# Altium project E32.PrjPcb
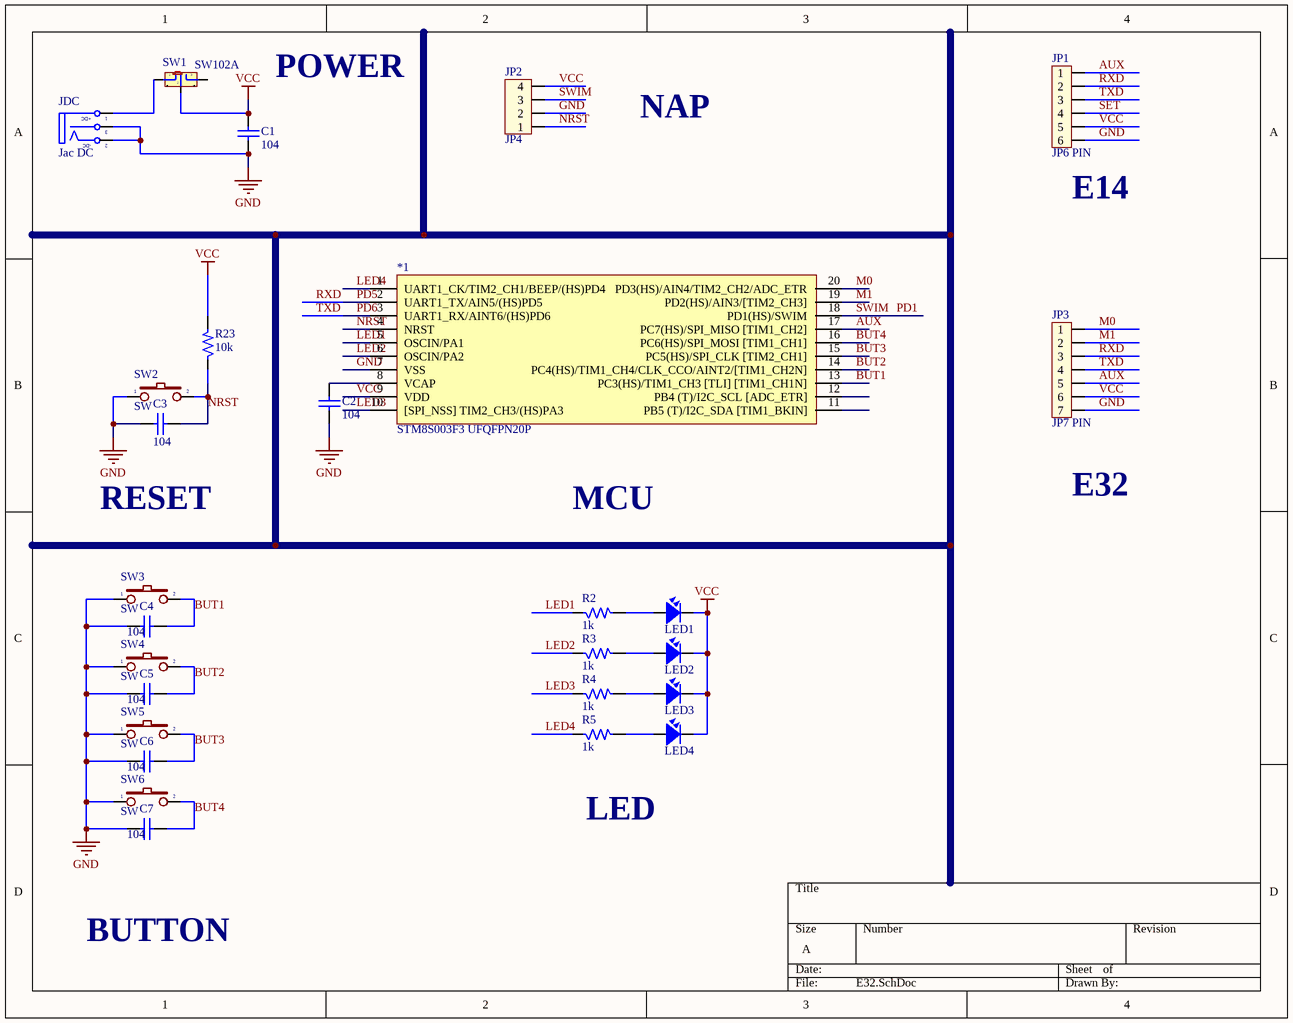
[diagram p0: E32.SchDoc]
1 sheet, 27 parts. Net scope: global (net labels, ports and power ports of the same name join across sheets).
Board files: E32.PcbDoc, MACHIN.PcbDoc

## Sheet E32.SchDoc
size A

### Parts
*1  STM8S003F3 UFQFPN20P  [TSOP65-20BN]
C1  104  [SM-CAP-0805]
C2  104  [SM-CAP-0805]
C3  104  [SM-CAP-0805]
C4  104  [SM-CAP-0805]
C5  104  [SM-CAP-0805]
C6  104  [SM-CAP-0805]
C7  104  [SM-CAP-0805]
JDC  Jac DC  [DC-IN]
JP1  JP6 PIN  [JP6]
JP2  JP4  [CON4]
JP3  JP7 PIN  [JP7]
LED1  LED  [LED-3]  (value not drawn)
LED2  LED  [LED-3]  (value not drawn)
LED3  LED  [LED-3]  (value not drawn)
LED4  LED  [LED-3]  (value not drawn)
R2  1k  [SM-RES-1206]
R3  1k  [SM-RES-1206]
R4  1k  [SM-RES-1206]
R5  1k  [SM-RES-1206]
R23  10k  [SM-RES-1206]
SW1  SW102A  [SW102T]
SW2  SW  [SW2]
SW3  SW  [SW2]
SW4  SW  [SW2]
SW5  SW  [SW2]
SW6  SW  [SW2]

### Nets
GND: *1.7(VSS) C1.1 C2.1 C3.1 C4.1 C5.1 C6.1 C7.1 JDC.2(TN) JDC.3(S) JP1.6 JP2.2 JP3.7 SW2.1 SW3.1 SW4.1 SW5.1 SW6.1
VCC: *1.9(VDD) C1.2 JP1.5 JP2.4 JP3.6 LED1.2 LED2.2 LED3.2 LED4.2 R23.2 SW1.2
AUX: *1.17(PC7(HS)/SPI_MISO_[TIM1_CH2]) JP1.1 JP3.5
BUT1: *1.13(PC3(HS)/TIM1_CH3_[TLI]_[TIM1_CH1N]) C4.2 SW3.2
BUT2: *1.14(PC4(HS)/TIM1_CH4/CLK_CCO/AINT2/[TIM1_CH2N]) C5.2 SW4.2
BUT3: *1.15(PC5(HS)/SPI_CLK_[TIM2_CH1]) C6.2 SW5.2
BUT4: *1.16(PC6(HS)/SPI_MOSI_[TIM1_CH1]) C7.2 SW6.2
LED1: *1.5(OSCIN/PA1) R2.1
LED2: *1.6(OSCIN/PA2) R3.1
LED3: *1.10([SPI_NSS]_TIM2_CH3/(HS)PA3) R4.1
LED4: *1.1(UART1_CK/TIM2_CH1/BEEP/(HS)PD4) R5.1
M0: *1.20(PD3(HS)/AIN4/TIM2_CH2/ADC_ETR) JP3.1
M1: *1.19(PD2(HS)/AIN3/[TIM2_CH3]) JP3.2
NRST: *1.4(NRST) C3.2 JP2.1 R23.1 SW2.2
PD1: *1.18(PD1(HS)/SWIM) JP2.3  [also labelled SWIM]
PD5: *1.2(UART1_TX/AIN5/(HS)PD5) JP1.2 JP3.3  [also labelled RXD]
PD6: *1.3(UART1_RX/AINT6/(HS)PD6) JP1.3 JP3.4  [also labelled TXD]
SET: JP1.4
Net*1_8: *1.8(VCAP) C2.2
NetJDC_1: JDC.1(T) SW1.1
NetLED1_1: LED1.1 R2.2
NetLED2_1: LED2.1 R3.2
NetLED3_1: LED3.1 R4.2
NetLED4_1: LED4.1 R5.2

Not connected (* = marked no-connect by the designer): *1 11(PB5_(T)/I2C_SDA_[TIM1_BKIN]) 12(PB4_(T)/I2C_SCL_[ADC_ETR]); SW1 3 4 5

### Notes on the sheet
- (near C1) POWER
- NAP
- (near JP1) E14
- E32
- RESET
- MCU
- LED
- BUTTON
- (in symbol DCIN) +DC; -DC

### Library data of the parts
C1-C7 = Cap: Capacitor (Semiconductor SIM Model); Value: 104
JDC = DCIN: Jac DC input; Value: Jac DC
JP1 = JP6: Value: JP7
JP2 = Con4: Connector 4; Value: Connector 4
JP3 = JP7: Value: JP7
LED1-LED4 = LED: LED Single colour Green and Red; Value: LED 3 ly Single Colour
R2-R5 R23 = R: Resistor 1/4W; Value: R1/4W - 1K
SW1 = SW102A: Switch 102 on Broad; Value: Switch 102 On Board
SW2-SW6 = SW2: Switch button 2 pin; Value: SW chip 2 pin